# Altium schematic sheet Motor4.SchDoc
size A; SheetNumber: 7; SheetTotal: 8
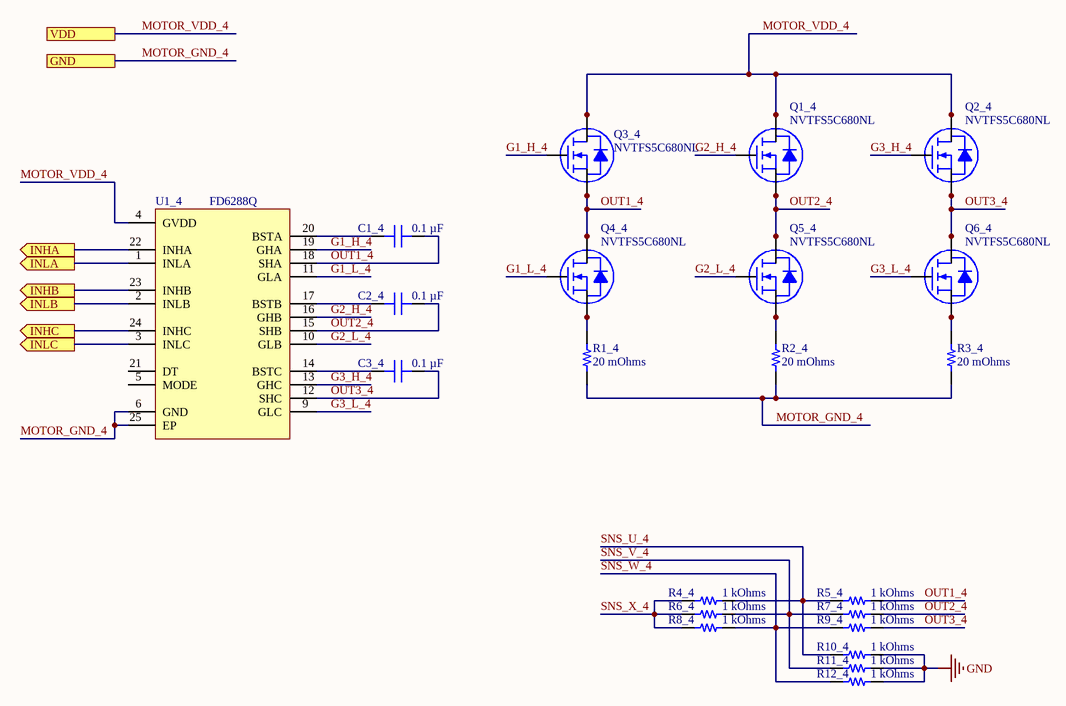
[diagram p0: Motor4.SchDoc]

## Parts
C1_4  0.1 µF  [CAP 0402_1005]
C2_4  0.1 µF  [CAP 0402_1005]
C3_4  0.1 µF  [CAP 0402_1005]
Q1_4  NVTFS5C680NL  [NVTFS015N04CTAG]
Q2_4  NVTFS5C680NL  [NVTFS015N04CTAG]
Q3_4  NVTFS5C680NL  [NVTFS015N04CTAG]
Q4_4  NVTFS5C680NL  [NVTFS015N04CTAG]
Q5_4  NVTFS5C680NL  [NVTFS015N04CTAG]
Q6_4  NVTFS5C680NL  [NVTFS015N04CTAG]
R1_4  20 mOhms  [STACKPOLE CSR0805]
R2_4  20 mOhms  [STACKPOLE CSR0805]
R3_4  20 mOhms  [STACKPOLE CSR0805]
R4_4  1 kOhms  [RES 0402_1005]
R5_4  1 kOhms  [RES 0402_1005]
R6_4  1 kOhms  [RES 0402_1005]
R7_4  1 kOhms  [RES 0402_1005]
R8_4  1 kOhms  [RES 0402_1005]
R9_4  1 kOhms  [RES 0402_1005]
R10_4  1 kOhms  [RES 0402_1005]
R11_4  1 kOhms  [RES 0402_1005]
R12_4  1 kOhms  [RES 0402_1005]
U1_4  FD6288Q  [QFN50P400X400X100-25N]

## Ports
GND, INHA (out), INHB (out), INHC (out), INLA (out), INLB (out), INLC (out), VDD

## Nets
GND: R10_4.1 R11_4.1 R12_4.1
G1_H_4: Q3_4.4(G) U1_4.19(GHA)
G1_L_4: Q4_4.4(G) U1_4.11(GLA)
G2_H_4: Q1_4.4(G) U1_4.16(GHB)
G2_L_4: Q5_4.4(G) U1_4.10(GLB)
G3_H_4: Q2_4.4(G) U1_4.13(GHC)
G3_L_4: Q6_4.4(G) U1_4.9(GLC)
INHA: U1_4.22(INHA) ; port INHA
INHB: U1_4.23(INHB) ; port INHB
INHC: U1_4.24(INHC) ; port INHC
INLA: U1_4.1(INLA) ; port INLA
INLB: U1_4.2(INLB) ; port INLB
INLC: U1_4.3(INLC) ; port INLC
MOTOR_GND_4: R1_4.1 R2_4.1 R3_4.1 U1_4.6(GND) U1_4.25(EP) ; port GND
MOTOR_VDD_4: Q1_4.5(D) Q1_4.6(D) Q1_4.7(D) Q1_4.8(D) Q2_4.5(D) Q2_4.6(D) Q2_4.7(D) Q2_4.8(D) Q3_4.5(D) Q3_4.6(D) Q3_4.7(D) Q3_4.8(D) U1_4.4(GVDD) ; port VDD
OUT1_4: C1_4.2 Q3_4.1(S) Q3_4.2(S) Q3_4.3(S) Q4_4.5(D) Q4_4.6(D) Q4_4.7(D) Q4_4.8(D) R5_4.2 U1_4.18(SHA)
OUT2_4: C2_4.2 Q1_4.1(S) Q1_4.2(S) Q1_4.3(S) Q5_4.5(D) Q5_4.6(D) Q5_4.7(D) Q5_4.8(D) R7_4.2 U1_4.15(SHB)
OUT3_4: C3_4.2 Q2_4.1(S) Q2_4.2(S) Q2_4.3(S) Q6_4.5(D) Q6_4.6(D) Q6_4.7(D) Q6_4.8(D) R9_4.2 U1_4.12(SHC)
SNS_U_4: R4_4.2 R5_4.1 R10_4.2
SNS_V_4: R6_4.2 R7_4.1 R11_4.2
SNS_W_4: R8_4.2 R9_4.1 R12_4.2
SNS_X_4: R4_4.1 R6_4.1 R8_4.1
NetC1_4_1: C1_4.1 U1_4.20(BSTA)
NetC2_4_1: C2_4.1 U1_4.17(BSTB)
NetC3_4_1: C3_4.1 U1_4.14(BSTC)
NetQ4_4_1: Q4_4.1(S) Q4_4.2(S) Q4_4.3(S) R1_4.2
NetQ5_4_1: Q5_4.1(S) Q5_4.2(S) Q5_4.3(S) R2_4.2
NetQ6_4_1: Q6_4.1(S) Q6_4.2(S) Q6_4.3(S) R3_4.2

Not connected (* = marked no-connect by the designer): U1_4 5(MODE) 21(DT)

## Library data of the parts
C1_4 C2_4 C3_4 = C0402C104K4RACAUTO: CAP CER 0.1UF 16V X7R 0402; manufacturer: KEMET; Tolerance: ±10%; Part Number: C0402C104K4RACAUTO; Value: 0.1 µF; Applications: Automotive, Bypass, Decoupling; Capacitance: 0.1 µF; componentlink1description: Datasheet; componentlink1url: https://api.kemet.com/component-edge/download/specsheet/C0402C104K4RACAUTO.pdf; componentlink2description: DigiKey Link; componentlink2url: https://www.digikey.com/en/products/detail/kemet/C0402C104K4RACAUTO/3314827; Device Package: 0402 (1005 Metric); lastupdated: 8/14/2022 9:05:51 PM; Lifecycle Status: Active; Minimum Order: 1; Mounting Type: Surface Mount, MLCC; Operating Temperature: -55°C ~ 125°C; Package / Case: 0402 (1005 Metric); packaging: TapeAndReel; partid: 3024; Part Status: Active; price: 0.01; Ratings: AEC-Q200; series: SMD Auto X7R; Size / Dimension: 0.039" L x 0.020" W (1.00mm x 0.50mm); Supplier 1: DigiKey; Supplier Part Number 1: 399-6828-1-ND; Temperature Coefficient: X7R; Thickness (Max): 0.022" (0.55mm); Voltage - Rated: 16V
Q1_4 Q2_4 Q3_4 Q4_4 Q5_4 Q6_4 = NVTFS5C680NL: N-FET
R1_4 R2_4 R3_4 = ERJ-3BWFR020V: RES 0.02 OHM 1% 1/3W 0603; Manufacturer: Panasonic Electronic Components; Power (Watts): 0.333W, 1/3W; Temperature Coefficient: ±250ppm/°C; Part Number: ERJ-3BWFR020V; Package / Case: 0603 (1608 Metric); ComponentLink1Description: Datasheet; ComponentLink1URL: https://industrial.panasonic.com/cdbs/www-data/pdf/RDN0000/AOA0000C313.pdf; ComponentLink2Description: DigiKey Link; ComponentLink2URL: https://www.digikey.com/en/products/detail/panasonic-electronic-components/ERJ-3BWFR020V/5647494; Composition: Thick Film; Device Package: 0603 (1608 Metric); Features: Automotive AEC-Q200, Current Sense; Height - Seated (Max): 0.026" (0.65mm); LastUpdated: 8/14/2022 9:50:04 PM; Lifecycle Status: Active; Minimum Order: 1; Number of Terminations: 2; Operating Temperature: -55°C ~ 155°C; Packaging: TapeAndReel; PartId: 64; Part Status: Active; Price: 0.06; Ratings: AEC-Q200; Resistance: 20 mOhms; Series: ERJ-3BW; Size / Dimension: 0.063" L x 0.031" W (1.60mm x 0.80mm); Supplier 1: DigiKey; Supplier Part Number 1: P17461CT-ND; Supplier Device Package: 0603; Tolerance: ±1%; Value: 20 mOhms
R4_4 R5_4 R6_4 R7_4 R8_4 R9_4 R10_4 R11_4 R12_4 = RK73H1ETTP1432F: RES 14.3K OHM 1% 1/10W 0402; Manufacturer: KOA Speer Electronics, Inc.; Power (Watts): 0.1W, 1/10W; Resistance: 14.3 kOhms; Temperature Coefficient: ±100ppm/°C; Part Number: RK73H1ETTP1432F; Value: 1 kOhms; ComponentLink1Description: Datasheet; ComponentLink1URL: http://www.koaspeer.com/catimages/Products/RK73H/RK73H.pdf; ComponentLink2Description: DigiKey Link; ComponentLink2URL: https://www.digikey.com/en/products/detail/koa-speer-electronics-inc/RK73H1ETTP1432F/9844351; Composition: Thick Film; Device Package: 0402 (1005 Metric); Features: Automotive AEC-Q200, Moisture Resistant; Height - Seated (Max): 0.016" (0.40mm); LastUpdated: 8/14/2022 9:23:49 PM; Lifecycle Status: Active; Minimum Order: 1; Number of Terminations: 2; Operating Temperature: -55°C ~ 155°C; Package / Case: 0402 (1005 Metric); Packaging: CutTape; PartId: 10193; Part Status: Active; Price: 0.01; Ratings: AEC-Q200; Series: RK73H; Size / Dimension: 0.039" L x 0.020" W (1.00mm x 0.50mm); Supplier 1: DigiKey; Supplier Part Number 1: 2019-RK73H1ETTP1432FCT-ND; Supplier Device Package: 0402; Tolerance: ±1%
U1_4 = FD6288Q: 3 Phase Gate Driver 1.5-2.2A; MF: Texas Instruments; MP: UCC27282DRCR; Texas_Instruments-Purchase-URL: https://snapeda.com/shop?store=Texas+Instruments&id=3625400; Price: None; Availability: Warning; Package: VSON-10 Texas Instruments; SnapEDA_Link: https://www.snapeda.com/parts/UCC27282DRCR/Texas%20Instruments/view-part/3625400/?ref=snap; DigiKey-Purchase-URL: https://snapeda.com/shop?store=DigiKey&id=3625400; Value: *